# EasyEDA Pro project ProPrj_25电赛_2025-08-03-final.epro, board PCB3
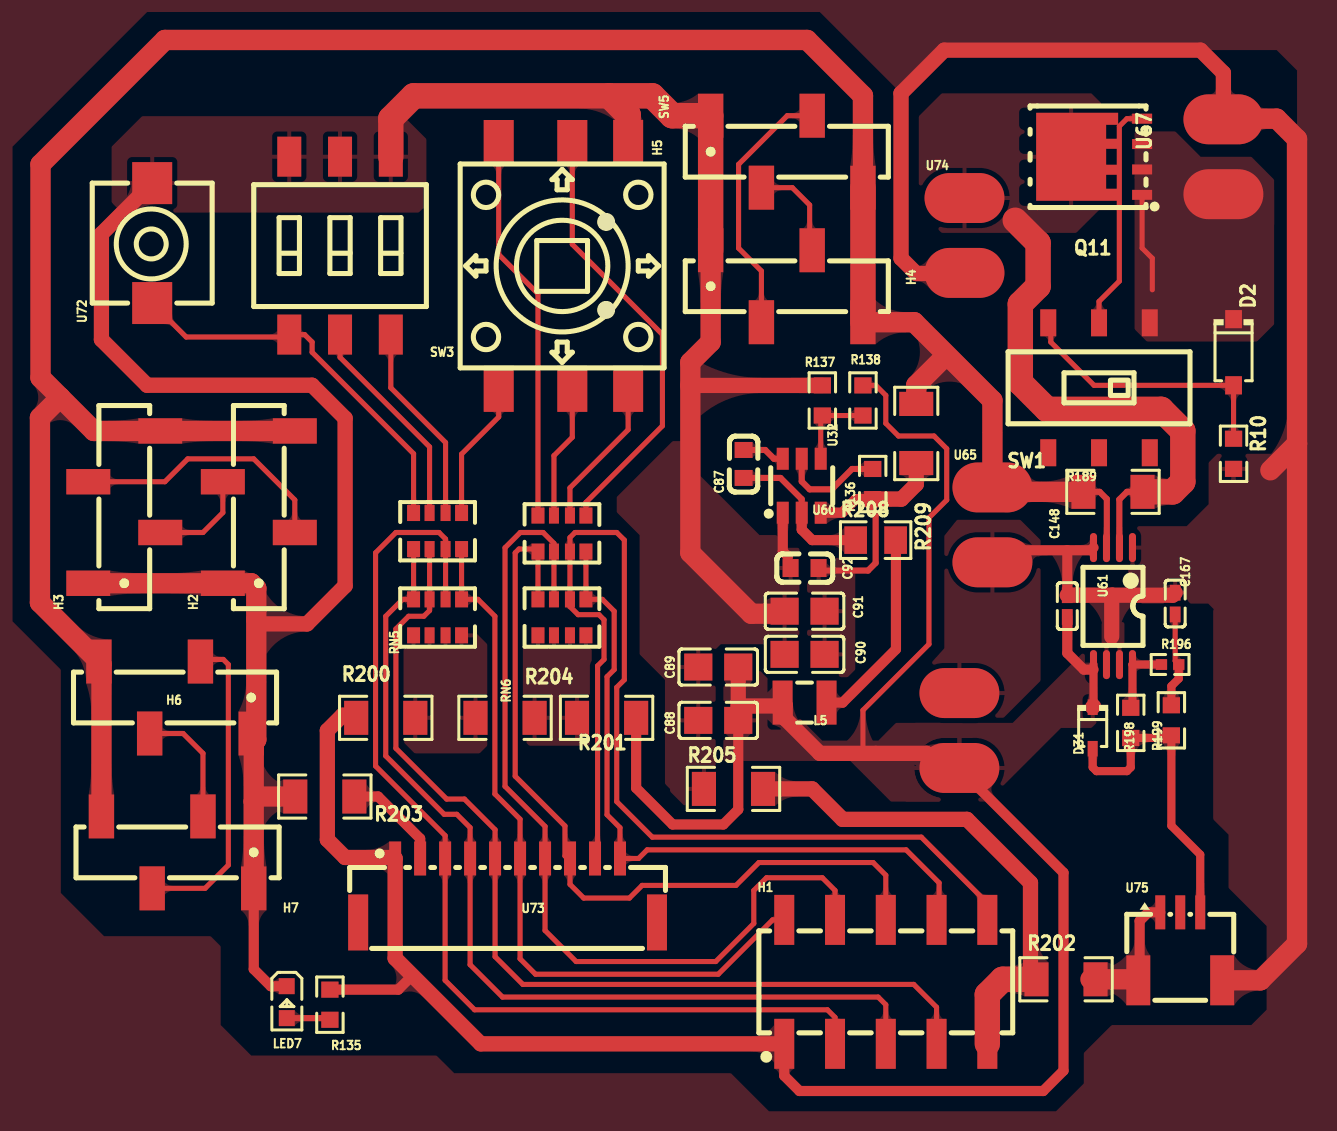
[diagram p10: board, top side]
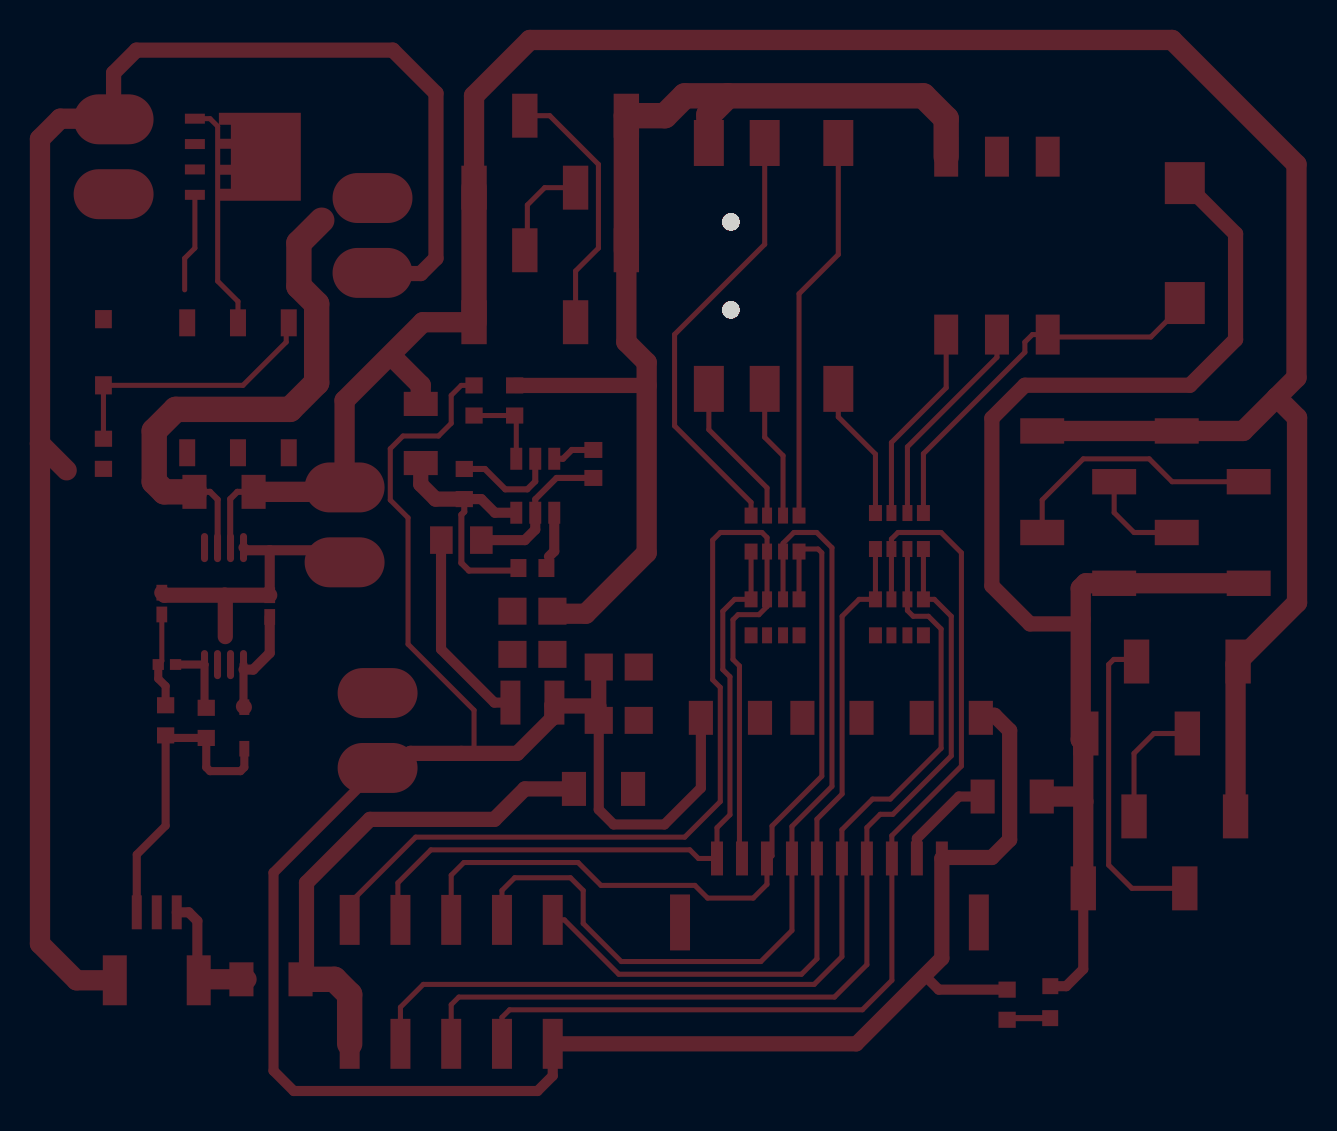
[diagram p11: board, bottom side, seen from below]

Outline 0.89 x 5.29 mm; copper layers: Top Layer, Bottom Layer. Coordinates in mm from the lower left corner of the outline.
Stack: Top Layer 0.035mm / Dielectric1 1.51mm FR4 er 4.5 / Bottom Layer 0.035mm

## Design rules (mm)
template: 自定义配置
spacing copperThickness1oz (default): track to track 0.102, other pairs 0.152 to 0.3
spacing copperThickness2oz: track to track 0.203, other pairs 0.152 to 0.3
track width copperThickness1oz (default): min 0.127, default 0.254, max 2.54
track width copperThickness2oz: min 0.203, default 0.254, max 2.54
differential pair differentialPair (default): width min 0.127, default 0.254, max 2.54; gap min 0.152, default 0.152
via viaSize (default): diameter min 0.5, default 0.61, max 10; hole min 0.3, default 0.305, max 6.299
net VCC_BAT uses vbat

## Placement (name value [footprint] x y rotation side)
C87  100nF  [C0603]  7.33 -7.26 90 top
C88  22uF  [C0805]  6.06 -20.09 0 top
C89  22uF  [C0805]  6.06 -17.42 0 top
C90  10uF  [C0805]  10.38 -16.79 180 top
C91  10uF  [C0805]  10.38 -14.63 180 top
C92  100nF  [C0603]  10.38 -12.47 180 top
C148  100nF  [C0402]  23.52 -14.37 90 top
C167  100nF  [C0402]  28.92 -14.25 270 top
D2  BZT52C16  [SOD-123_L2.7-W1.7-LS3.8-RD]  31.84 -1.67 270 top
D31  1N4148WS  [SOD-323_L1.7-W1.3-LS2.5-FD]  24.79 -20.47 90 top
H1  B-2100N10P-B110  [HDR-SMD_10P-P2.54-V-M-R2-C5-S2.54-LS7.3]  14.44 -33.17 0 top
H2  X6511WVS-04H-C60D48R1  [HDR-SMD_4P-P2.54-V-M-S4.8]  -16.93 -9.42 90 top
H3  X6511WVS-04H-C60D48R1  [HDR-SMD_4P-P2.54-V-M-S4.8]  -23.66 -9.42 90 top
H4  X6511WVS-04H-C60D48R1  [HDR-SMD_4P-P2.54-V-M-S4.8]  9.49 1.63 0 top
H5  X6511WVS-04H-C60D48R1  [HDR-SMD_4P-P2.54-V-M-S4.8]  9.49 8.36 0 top
H6  X6511WVS-04H-C60D48R1  [HDR-SMD_4P-P2.54-V-M-S4.8]  -21.12 -18.94 180 top
H7  X6511WVS-04H-C60D48R1  [HDR-SMD_4P-P2.54-V-M-S4.8]  -20.99 -26.69 180 top
L5  2.2uH  [IND-SMD_L2.5-W2.0_MHCHL2520]  10.38 -19.2 0 top
LED7  NCD0603R1  [LED0603-RD_RED]  -15.53 -34.18 270 top
Q11  TPH1R403NL  [POWERVDFN-8_L6.2-W5.2-P1.27-LS6.0-BL]  25.49 8.11 90 top
R10  10K  [R0603]  31.84 -6.75 90 top
R135  4.7K  [R0603]  -13.37 -34.31 90 top
R136  10kΩ  [R0603]  13.78 -8.27 90 top
R137  10kΩ  [R0603]  11.26 -4.09 270 top
R138  33.2kΩ  [R0603]  13.3 -4.09 270 top
R189  10mΩ  [R1206]  25.81 -8.66 0 top
R196  150kΩ  [R0402]  28.66 -17.29 0 top
R198  0Ω  [R0603]  26.69 -20.21 90 top
R199  0Ω  [R0603]  28.73 -20.09 270 top
R200  0Ω  [R1206]  -10.58 -19.96 0 top
R201  0Ω  [R1206]  -4.61 -19.96 180 top
R202  0Ω  [R1206]  23.46 -33.04 0 top
R203  0Ω  [R1206]  -13.63 -23.9 180 top
R204  0Ω  [R1206]  0.47 -19.96 0 top
R205  0Ω  [R1206]  6.82 -23.52 0 top
R208  10K  [R0805]  13.93 -11.07 0 top
R209  0Ω  [R1206]  15.96 -5.74 90 top
RN3  100Ω  [RES-ARRAY-SMD_0603-8P-L3.2-W1.6-BL]  -7.99 -10.62 180 top
RN4  100Ω  [RES-ARRAY-SMD_0603-8P-L3.2-W1.6-BL]  -1.76 -10.74 0 top
RN5  1kΩ  [RES-ARRAY-SMD_0603-8P-L3.2-W1.6-BL]  -7.99 -14.93 180 top
RN6  1kΩ  [RES-ARRAY-SMD_0603-8P-L3.2-W1.6-BL]  -1.76 -14.93 180 top
SW1  SS-3235S-L3  [SW-SMD_SS-3235S-L3.00]  25.11 -3.45 180 top
SW3  DSIC03LS-P  [SW-SMD_6P-L8.6-W6.2-P2.54-LS9.8]  -12.87 3.66 180 top
SW5  K1-1504SA-06  [SW-SMD_K1-1504SA-06]  -1.69 2.65 270 top
U32  TPS563201DDCR  [SOT-23-6_L2.9-W1.6-P0.95-LS2.8-BR]  10.23 -8.35 270 top
U60  -  [2P焊接端子（大电流）]  18.12 -20.6 180 top
U61  INA240A2PWR  [TSSOP-8_L4.4-W3.0-P0.65-LS6.4-BL]  25.81 -14.37 180 top
U65  -  [2P焊接端子（大电流）]  19.77 -10.31 0 top
U67  -  [2P焊接端子（大电流）]  31.33 8.11 180 top
U72  SKPMAQE010  [KEY-SMD_2P-L6.0-W6.0-P6.00]  -22.26 3.79 90 top
U73  WAFER-GH1.25-10PWB  [CONN-SMD_10P-P1.25_XUNPU_WAFER-GH1.25-10PWB]  -4.48 -28.6 0 top
U74  -  [2P焊接端子（大电流）]  18.38 4.17 0 top
U75  ZX-SH1.0-3PWT  [CONN-SMD_3P-P1.00_MEGASTAR_ZX-SH1.0-3PWT]  29.17 -31.39 0 top

## Footprints (pads in the part's own frame, mm; a bottom-side part is the same pattern mirrored in y, then rotated)
2P焊接端子（大电流）
  oval 4x2.5 smd: 1(0,1.873) 2(0,-1.873)
C0402
  rect 0.79x0.54 smd: 1(-0.545,0) 2(0.545,0)
C0603
  rect 0.8x0.9 smd: 1(-0.7,0) 2(0.7,0)
C0805
  rect 1.41x1.35 smd: 1(-1,0) 2(1,0)
CONN-SMD_3P-P1.00_MEGASTAR_ZX-SH1.0-3PWT
  rect 0.5x1.7 smd: 1(-1,1.7) 2(0,1.7) 3(1,1.7)
  rect 1.2x2.5 smd: 4(-2.1,-1.7) 5(2.1,-1.7)
CONN-SMD_10P-P1.25_XUNPU_WAFER-GH1.25-10PWB
  rect 0.6x1.7 smd: 1(-5.625,1.6) 2(-4.375,1.6) 3(-3.125,1.6) 4(-1.875,1.6) 5(-0.625,1.6) 6(0.625,1.6) 7(1.875,1.6) 8(3.125,1.6) 9(4.375,1.6) 10(5.625,1.6)
  rect 1x2.8 smd: 11(7.475,-1.6) 12(-7.475,-1.6)
HDR-SMD_4P-P2.54-V-M-S4.8
  rect 1.27x2.2 smd: 1(-3.81,1.8) 2(-1.27,-1.8) 3(1.27,1.8) 4(3.81,-1.8)
HDR-SMD_10P-P2.54-V-M-R2-C5-S2.54-LS7.3
  rect 1x2.5 smd: 1(-5.08,-3.1) 2(-5.08,3.1) 3(-2.54,-3.1) 4(-2.54,3.1) 5(0,-3.1) 6(0,3.1) 7(2.54,-3.1) 8(2.54,3.1) 9(5.08,-3.1) 10(5.08,3.1)
IND-SMD_L2.5-W2.0_MHCHL2520
  rect 1x2.2 smd: 1(-1.1,0) 2(1.1,0)
KEY-SMD_2P-L6.0-W6.0-P6.00
  rect 2.1x2 smd: 1(-3,0) 2(3,0)
LED0603-RD_RED
  rect 0.8x0.8 smd: 1(-0.799,-0.004) 2(0.799,0.004)
POWERVDFN-8_L6.2-W5.2-P1.27-LS6.0-BL
  rect 0.5x1 smd: 1(-1.905,-1.775) 2(-0.635,-1.775) 3(0.635,-1.775) 4(1.905,-1.775)
  custom 4.4x4.1 smd: 5(0,1.775)
R0402
  rect 0.566x0.54 smd: 1(-0.433,0) 2(0.433,0)
R0603
  rect 0.806x0.864 smd: 1(-0.753,0) 2(0.753,0)
R0805
  rect 1.133x1.377 smd: 1(-1,0) 2(1,0)
R1206
  rect 1.208x1.701 smd: 1(-1.479,0) 2(1.479,0)
RES-ARRAY-SMD_0603-8P-L3.2-W1.6-BL
  rect 0.65x0.8 smd: 1(-1.2,-0.9) 4(1.2,-0.9) 5(1.2,0.9) 8(-1.2,0.9)
  rect 0.5x0.8 smd: 2(-0.4,-0.9) 3(0.4,-0.9) 6(0.4,0.9) 7(-0.4,0.9)
SOD-123_L2.7-W1.7-LS3.8-RD
  rect 0.91x0.84 smd: 1(-1.655,0) 2(1.655,0)
SOD-323_L1.7-W1.3-LS2.5-FD
  rect 0.78x0.5 smd: 1(-1.04,0) 2(1.04,0)
SOT-23-6_L2.9-W1.6-P0.95-LS2.8-BR
  rect 1.1x0.6 smd: 1(1.35,-0.95) 2(1.35,0) 3(1.35,0.95) 4(-1.35,0.95) 5(-1.35,0) 6(-1.35,-0.95)
SW-SMD_6P-L8.6-W6.2-P2.54-LS9.8
  rect 1.2x2 smd: 1(-2.54,-4.45) 2(0,-4.45) 3(2.54,-4.45) 4(2.54,4.45) 5(0,4.45) 6(-2.54,4.45)
SW-SMD_K1-1504SA-06
  rect 2.3x1.5 smd: 1(-6.15,3.239) 2(-6.15,0.445) 3(-6.15,-3.239) 4(6.15,3.239) 5(6.15,0.445) 6(6.15,-3.239)
SW-SMD_SS-3235S-L3.00
  rect 0.8x1.35 smd: 1(2.54,3.25) 2(0,3.25) 3(-2.54,3.25) 4(2.54,-3.25) 5(0,-3.25) 6(-2.54,-3.25)
TSSOP-8_L4.4-W3.0-P0.65-LS6.4-BL
  oval 0.353x1.454 smd: 1(-0.975,-2.927) 2(-0.325,-2.927) 3(0.325,-2.927) 4(0.975,-2.927) 5(0.975,2.927) 6(0.325,2.927) 7(-0.325,2.927) 8(-0.975,2.927)

## Nets
As in the schematic.

Pads without a net: SW1 1 2 3; U73 11 12; U75 2

## Routing (per net, layer and track width the routed paths; a pad name or vN(x,y) marks a point on that pad's centre or on a via; arc(x,y) is an arc through that point)
+5V_IN: length 26.6
  Top Layer w0.305: U61.2 26.12,-11.44 26.12,-9.04 26.51,-8.66 R189.2
  Top Layer w1.27: 20.92,4.93 22.06,3.79 22.06,1.63 21.17,0.74 21.17,-3.2 22.5,-4.53 28.22,-4.53 29.3,-5.61 29.3,-8.15 28.79,-8.66 R189.2
GND: length 258.1
  Top Layer w0.508: R203.1 -10.96,-23.9 -8.86,-26 U73.2 ; 20.66,-12.21 21.3,-11.58 23.52,-11.58 ; H7.1 -17.18,-32.53 -16.33,-33.38 LED7.1 ; 9.55,-11.89 9.28,-11.63 U32.1 ; U75.1 27.57,-29.69 27.14,-30.12 27.14,-33.02 U75.4 ; 23.52,-11.58 C148.2 ; 23.52,-11.58 24.7,-11.58 U61.4
  Top Layer w0.762: 31.33,10.9 31.33,12.3 30.19,13.44 17.36,13.44 15.2,11.28 15.2,3.03 15.96,2.26 17.49,2.26 ; 25.77,-13.83 25.74,-13.85 25.74,-15.9 ; 25.77,-13.83 28.79,-13.83 C167.1 ; 25.77,-13.83 C148.2 ; -17.06,-15.04 -16.84,-15.26 -14.52,-15.26 -12.61,-13.36 -12.61,-4.97 -14.26,-3.32 -22.52,-3.32 -24.8,-1.04 -24.8,4.25 U72.2 ; 21.68,-32.79 21.68,-28.22 18.5,-25.04 12.28,-25.04 10.76,-23.52 8.3,-23.52 ; R137.1 4.66,-3.33
  Top Layer w1.016: -17.18,-24.15 -17.18,-21.18 ; -17.18,-24.15 H7.1 ; -17.18,-24.15 -16.93,-23.9 R203.2 ; -17.18,-21.18 -17.18,-20.87 H6.1 ; -17.18,-21.18 -17.06,-21.05 -17.06,-13.48 -17.31,-13.23 H2.1 H3.1 ; 24.68,-33.04 27.02,-33.04 U75.4 ; 35.01,-6.24 33.68,-7.58 ; 35.01,-6.24 35.01,9 34,10.01 32.22,10.01 ; 35.01,-6.24 35.01,-31.26 33.19,-33.09 U75.5 ; C91.2 9.38,-14.75 7.71,-14.75 4.66,-11.71 4.66,-2.18 5.68,-1.16 H4.1
  Top Layer w1.27: 0.6,11.15 -9.18,11.15 -10.33,10.01 SW3.1 ; 0.6,11.15 2.76,11.15 3.75,10.16 H5.1 H4.1 ; 0.6,11.15 1.55,10.2 SW5.1 ; H1.9 19.52,-33.8 20.28,-33.04 21.72,-33.04
VCC_3V3: length 131.2
  Top Layer w0.254: 13.3,-21.48 13.3,-19.58 16.6,-16.28 16.6,-9.95 17.49,-9.06 17.49,-6.5 16.85,-5.86 15.07,-5.86 14.44,-5.23 14.44,-3.83 13.94,-3.33 R138.1
  Top Layer w0.381: 13.93,-21.74 13.93,-21.82
  Top Layer w0.406: 24.83,-19.39 U61.5
  Top Layer w0.508: 23.52,-14.92 23.52,-16.72 24.35,-17.55 24.83,-17.55 ; H1.1 9.36,-37.87 10.12,-38.63 22.31,-38.63 23.33,-37.61 23.33,-27.71 19.01,-23.39 ; -13.5,-33.56 -9.95,-33.56 -9.44,-33.04 ; R204.2 1.95,-23.47 3.77,-25.29 6.31,-25.29 7.06,-24.55 C88.2
  Top Layer w0.762: -12.61,-19.83 -12.74,-19.83 -13.5,-20.6 -13.5,-26.06 -12.61,-26.95 -10.16,-26.95 U73.1 -10.11,-31.99 -5.83,-36.27 H1.1 ; C88.2 7.06,-19.37 ; 7.06,-19.37 9.11,-19.37 L5.1 9.4,-19.33 9.4,-20 11.14,-21.74 16.47,-21.74 17.23,-22.5 18.12,-22.5 ; 7.06,-19.37 7.06,-17.93 ; D31.2 24.83,-19.39
VCC_5V: length 138.5
  Top Layer w0.305: R136.1 13.78,-9.65 13.93,-9.8 13.93,-12.21 13.55,-12.59 11.2,-12.59 C92.1 ; 24.71,-8.66 25.14,-8.66 25.5,-9.01 25.5,-11.43 U61.3
  Top Layer w0.508: R136.1 12.93,-9.02 12.25,-9.7 U32.3
  Top Layer w0.762: R209.1 15.96,-8.28 15.22,-9.02 R136.1
  Top Layer w1.016: H5.4 13.3,11.15 10.5,13.95 -21.63,13.95 -27.85,7.73 -27.85,-2.94 -26.86,-3.93 ; R189.1 20.91,-8.66 20.66,-8.4 ; -26.86,-3.93 -25.18,-5.61 H3.4 -15.13,-5.61 ; -26.86,-3.93 -27.88,-4.95 -27.88,-14.2 H6.4 -24.8,-17.27 -24.8,-24.89 ; H4.4 15.86,-0.17 19.77,-4.09 19.77,-7.51 ; 17.36,-1.93 15.96,-3.32 R209.2 ; 18.88,-8.4 19.65,-8.4
  Top Layer w1.27: H5.4 H4.4
VCC_BAT: length 5
  Top Layer w0.254: 27.26,6.2 27.26,3.54 27.77,3.03 27.77,1.45
C10: length 47.4
  Top Layer w0.254: H1.5 14.44,-34.31 14.06,-33.93 -4.74,-33.93 -6.36,-32.31 U73.4 -6.36,-25.45 -7.02,-24.79 -7.66,-24.79 -10.58,-21.87 -10.58,-14.88 -9.73,-14.03 RN5.4 RN3.5
C11: length 40.6
  Top Layer w0.254: RN4.1 RN6.4 ; -3.09,-11.64 -3.22,-11.52 -3.91,-11.52 -4.1,-11.71 -4.1,-22.88 -1.61,-25.37 -1.61,-26.87 -1.49,-27 U73.8 -1.36,-28.29 -0.67,-28.98 1.61,-28.98 2.25,-28.34 6.95,-28.34 8.09,-27.2 13.8,-27.2 14.44,-27.83 H1.6
C12: length 35.6
  Top Layer w0.254: RN4.4 RN6.1 0.26,-14.03 0.85,-14.63 0.85,-17.55 0.49,-17.91 0.49,-24.81 1.14,-25.46 U73.10 2.07,-27 2.5,-26.56 15.46,-26.56 17.11,-28.22 17.11,-29.94 H1.8
C13: length 55.3
  Top Layer w0.254: U73.9 -0.11,-26.79 0.02,-26.66 0.02,-17.36 0.34,-17.04 0.34,-15.05 0.09,-14.8 -0.96,-14.8 -1.36,-14.39 RN6.2 RN4.3 -1.36,-10.94 -1.11,-10.69 0.98,-10.69 1.36,-11.07 1.36,-18.06 0.98,-18.44 0.98,-24.15 2.76,-25.93 16.22,-25.93 19.52,-29.23 H1.10
C14: length 45.4
  Top Layer w0.254: H1.4 11.9,-28.6 11.26,-27.96 8.47,-27.96 7.84,-28.6 7.84,-30.25 5.93,-32.15 -1.05,-32.15 -2.61,-30.6 U73.7 -2.61,-25.39 -4.61,-23.39 -4.61,-11.45 -3.85,-10.69 -2.71,-10.69 -2.16,-11.23 RN4.2 RN6.3
C15: length 36.9
  Top Layer w0.254: RN3.8 RN5.1 -5.97,-14.03 -5.12,-14.88 -5.12,-23.77 -3.86,-25.03 U73.6 -3.86,-32.02 -3.09,-32.79 6.06,-32.79 8.78,-30.07 H1.2
C26: length 51.5
  Top Layer w0.254: H1.3 11.9,-34.95 11.52,-34.57 -6.13,-34.57 -7.61,-33.09 U73.3 -7.61,-26.99 -7.61,-25.85 -11.09,-22.37 -11.09,-11.71 -10.07,-10.69 -7.91,-10.69 -7.59,-11.02 RN3.7 RN5.2
C27: length 49.1
  Top Layer w0.254: RN3.6 RN5.3 -8.39,-14.59 -8.67,-14.88 -9.44,-14.88 -10.07,-15.52 -10.07,-21.48 -7.53,-24.02 -6.64,-24.02 -5.11,-25.56 U73.5 -5.11,-31.91 -3.72,-33.3 15.84,-33.3 16.98,-34.44 H1.7
I_OUT: length 16
  Top Layer w0.406: U75.3 30.17,-26.8 28.73,-25.36 R199.2 28.6,-20.97 R198.1 26.69,-22.44 26.5,-22.63 24.98,-22.63 24.79,-22.44 D31.1
L1: length 17.8
  Top Layer w0.305: U32.2 10.23,-9.02 9.17,-7.96 C87.1
  Top Layer w0.508: U32.2 10.23,-10.55 10.76,-11.07 R208.1 ; R208.2 14.95,-11.09 14.95,-16.53 12.28,-19.2 L5.2
$1N2451: length 3.6
  Top Layer w0.406: R196.1 26.79,-17.29 U61.8 26.78,-19.37 R198.2
$1N2466: length 4.8
  Top Layer w0.254: R196.2 28.92,-17.11 C167.2
  Top Layer w0.406: R196.2 29.1,-18 28.73,-18.37 R199.1
$1N2509: length 19.6
  Top Layer w0.254: U72.1 -20.56,-0.91 -15.53,-0.91 SW3.4 -14.64,-0.79 -14.26,-1.16 -14.26,-1.67 -9.19,-6.75 RN3.4
$1N2510: length 10.8
  Top Layer w0.254: SW3.5 -12.87,-1.93 -8.39,-6.41 RN3.3
$1N2511: length 10.1
  Top Layer w0.254: RN3.2 -7.59,-6.19 -10.33,-3.45 SW3.6
$1N2512: length 7
  Top Layer w0.254: RN3.1 -6.79,-6.77 -4.93,-4.91 SW5.6
$1N2513: length 19.5
  Top Layer w0.254: RN4.8 -2.96,1.25 -4.93,3.22 SW5.3
$1N2514: length 6.7
  Top Layer w0.254: RN4.7 -2.16,-6.84 -1.25,-5.93 SW5.5
$1N2515: length 7.5
  Top Layer w0.254: SW5.4 1.55,-5.55 -1.36,-8.46 RN4.6
$1N2516: length 22.1
  Top Layer w0.254: RN4.5 -0.56,-9.18 3.26,-5.36 3.26,-0.78 -1.25,3.73 SW5.2
$1N2556: length 5.1
  Top Layer w0.254: H3.2 -19.72,-10.69 -18.73,-9.7 H2.3
$1N2560: length 13.3
  Top Layer w0.254: H3.3 -21.63,-8.15 -20.49,-7.01 -17.18,-7.01 -15.13,-9.06 -15.13,-10.69
$1N2602: length 2.1
  Top Layer w0.305: -13.5,-35.06 -13.58,-34.98 LED7.2
$1N2604: length 2.1
  Top Layer w0.305: U32.6 8.85,-7 8.41,-6.56 C87.2
$1N2605: length 5.3
  Top Layer w0.305: R136.2 12.75,-7.51 11.73,-8.53 10.63,-8.53 10.23,-8.13 U32.5
$1N2607: length 4.2
  Top Layer w0.254: U32.4 11.18,-4.92 R137.2 R138.2
$1N2622: length 5.1
  Top Layer w0.254: H5.2 9.76,6.56 10.63,5.69 10.63,3.56 H4.3
$1N2626: length 13.1
  Top Layer w0.254: H4.2 8.22,2.39 7.07,3.53 7.07,7.73 9.51,10.16 H5.3
$1N2642: length 6.2
  Top Layer w0.254: H6.3 -20.72,-20.74 -19.72,-21.74 H7.2
$1N2646: length 15.2
  Top Layer w0.254: -19.22,-17.04 -18.71,-17.04 -18.45,-17.29 -18.45,-27.33 -19.62,-28.49 -22.26,-28.49
$1N2959: length 11.5
  Top Layer w0.254: SW1.5 25.11,0.87 26.12,1.88 26.12,9.63 26.5,10.01 Q11.4
$1N2963: length 14.2
  Top Layer w0.254: R10.2 D2.2 24.86,-3.33 22.69,-1.16 22.69,0.18 22.82,0.31

## Copper pours and planes (outline as drawn; the poured copper is in the pictures)
+5V_IN on Top Layer: 16.09,10.14 17.23,11.28 24.73,11.28 25.62,10.39 25.62,5.95 23.96,4.3 17.23,4.3 16.09,5.44
GND on Top Layer: 4.66,-7.36 8.12,-10.82 8.97,-10.82 9.28,-11.13 9.28,-11.33 8.77,-11.85 7.44,-11.85 6.57,-12.72 4.87,-12.72 4.66,-12.51
GND on Top Layer: 7.07,-11.45 10.12,-11.45 10.12,-17.16 9.85,-17.43 9.63,-17.43 8.47,-16.28 6.18,-16.28 5.93,-16.53 5.93,-24.51 4.51,-24.51 3.64,-23.64 3.64,-14.88
GND on Top Layer: 17.36,13.44 34,13.44 35.01,12.42 35.01,8.87 35.9,7.98 38.57,7.98 38.57,16.74 38.44,16.87 17.15,16.87 17.15,13.65
GND on Top Layer: 25.23,-18.06 26.38,-18.06 26.38,-15.17 25.23,-15.17
GND on Top Layer: 26.57,-10.5 26.69,-10.37 29.49,-10.37 30.59,-9.27 30.59,-7.19 31.03,-6.75 32.47,-6.75 32.6,-6.88 32.6,-11.04 29.39,-14.25 27.24,-14.25 26.57,-13.58
GND on Top Layer: 15.2,11.28 11.14,15.35 -22.52,15.35 -29.25,8.61 -29.25,-15.13 -26.84,-17.55 -26.84,-28.72 -24.68,-30.88 -19.34,-30.88 -18.83,-31.39 -18.83,-35.33 -17.31,-36.85 -8.04,-36.85 -7.15,-37.74 6.69,-37.74 8.6,-39.65 22.95,-39.65 24.35,-38.25 24.35,-36.72 25.74,-35.33 32.73,-35.33 33.49,-34.57 33.49,-32.79 35.01,-31.26 35.01,8.13 35.5,8.61 38.57,8.61 38.57,-41.04 -31.15,-41.04 -31.15,16.87 18.38,16.87 18.38,14.46
GND on Top Layer: 29.81,-12.21 29.81,-13.61 29.55,-13.86 29.55,-14.12 29.68,-14.25 30.57,-14.25 30.95,-14.63 33.74,-11.83 34.63,-11.83 34.63,-9.26 35.01,-8.88 35.01,-7.89 34.77,-7.64 34.63,-7.64 34.63,-7.47 35.35,-6.75 31.2,-6.75 31.08,-6.88 31.08,-9.17 30.95,-9.29 30.95,-11.07
GND on Top Layer: 30.82,-14.56 30.82,-25.04 31.58,-25.8 31.58,-28.47 33.49,-30.37 33.49,-33.3 34.12,-33.93 36.03,-32.03 36.03,-10.31 35.9,-10.18 35.2,-10.18
GND on Top Layer: 0.98,-8.91 0.98,-9.67 2.12,-10.82 2.12,-16.79 3.39,-18.06 3.39,-23.26 3.9,-23.77 4.15,-23.52 4.15,-15.13 6.1,-13.19 6.1,-13.14 4.66,-11.71 4.66,-6.32 4.46,-6.12 3.77,-6.12
GND on Top Layer: -24.3,8.61 -22.77,10.14 -9.69,10.14 -8.55,9 -8.55,5.69 -8.93,5.31 -23.79,5.31 -24.3,5.82
GND on Top Layer: 18,-10.05 21.17,-10.05 22.19,-11.07 22.19,-18.11 20.33,-19.96 15.98,-19.96 15.98,-18.02 17.37,-16.48 17.37,-10.86
VCC_3V3 on Top Layer: -3.74,-15.93 -2.81,-15.01 -0.27,-15.01 -0.27,-21.36 -3.4,-21.36 -3.74,-21.01
VCC_3V3 on Top Layer: 24.98,-16.66 24.35,-16.66 20.79,-20.21 15.9,-20.21 14.69,-21.42 14.69,-23.39 15.46,-24.15 19.52,-24.15 23.2,-20.47 24.73,-20.47 24.98,-20.21
VCC_3V3 on Top Layer: -9.86,-15.68 -9.56,-15.39 -6.39,-15.39 -5.5,-16.28 -5.5,-21.36 -5.88,-21.74 -9.13,-21.74 -9.86,-21.01
VCC_3V3 on Top Layer: 6.31,-17.42 6.57,-17.17 7.71,-17.17 8.47,-17.93 9.93,-17.93 10.12,-18.12 10.12,-19.96 11.26,-21.1 14.06,-21.1 14.95,-20.21 18.25,-20.21 19.77,-21.74 19.77,-23.26 18.88,-24.15 14.69,-24.15 12.66,-22.12 6.31,-22.12
VCC_5V on Top Layer: 10.76,-11.96 12.15,-11.96 12.92,-12.72 12.92,-17.55 12.53,-17.93 10.76,-17.93 10.5,-17.67 10.5,-12.21
VCC_BAT on Top Layer: 28.54,7.34 26.89,7.16 26.89,-0.52 27.5,-1.14 33.01,-1.14 33.87,-0.28 33.87,6.46 32.85,7.47 31.71,6.33
VCC_BAT on Top Layer: 26.89,9.38 28.92,9.38 30.19,8.11 32.73,8.11 33.87,6.96 33.87,4.68 33.66,4.47 30.65,4.47 28.16,6.96 26.89,6.96

Small or netless copper shapes (teardrops, artwork), in the pictures only: 192 on Top Layer
